# Altium project EP-GUIDE.PrjPcb
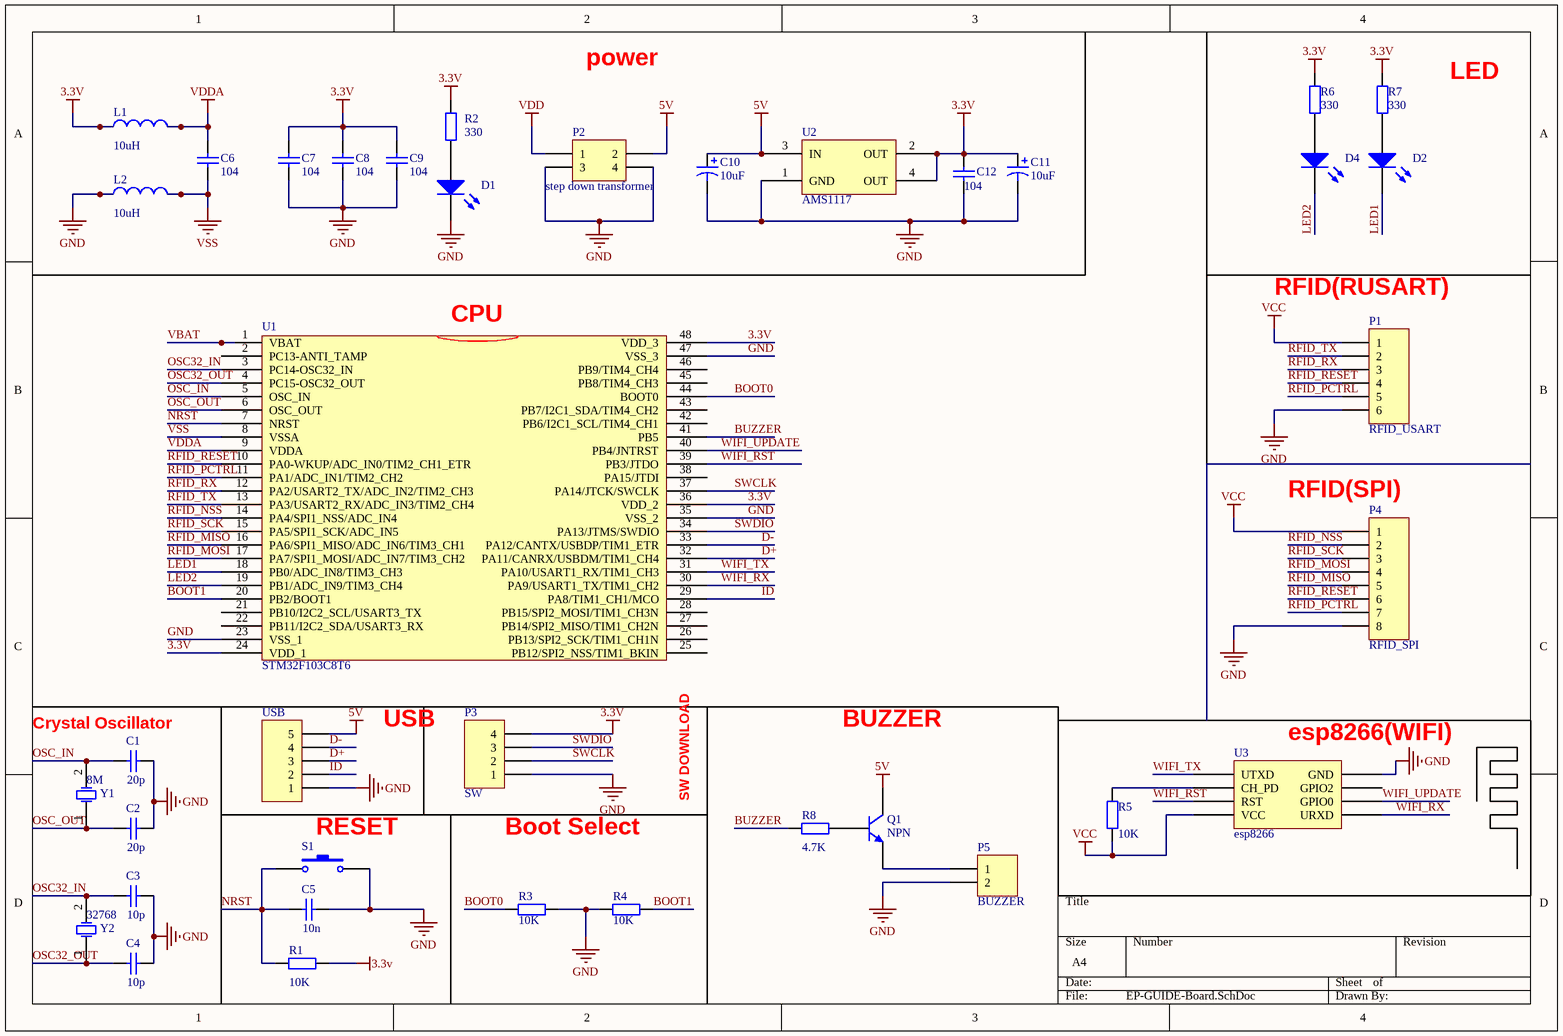
[diagram p0: EP-GUIDE-Board.SchDoc]
2 sheets, 76 parts. Net scope: global (net labels, ports and power ports of the same name join across sheets).
Sheets:
  EP-GUIDE-Board.SchDoc
  EP-GUIDE-Board2.SchDoc

## Sheet EP-GUIDE-Board.SchDoc
size A4

### Parts
(Parts that share a designator on the sheet are numbered #1, #2 ... from top to bottom, then left to right.)
C1#1  value 20p  [RAD-0.3]  (hidden comment: Cap)
C2#1  value 20p  [RAD-0.3]  (hidden comment: Cap)
C3#1  value 10p  [RAD-0.3]  (hidden comment: Cap)
C4#1  value 10p  [RAD-0.3]  (hidden comment: Cap)
C5#1  value 10n  [RAD-0.3]  (hidden comment: Cap)
C6#1  value 104  [RAD-0.3]  (hidden comment: Cap)
C7#1  value 104  [RAD-0.3]  (hidden comment: Cap)
C8#1  value 104  [RAD-0.3]  (hidden comment: Cap)
C9#1  value 104  [RAD-0.3]  (hidden comment: Cap)
C10#1  value 10uF  [C0805]  (hidden comment: Cap Pol3)
C11#1  value 10uF  [C0805]  (hidden comment: Cap Pol3)
C12#1  value 104  [RAD-0.3]  (hidden comment: Cap)
D1#1  LED3  [3.5X2.8X1.9]  (value not drawn)
D2#1  LED3  [3.5X2.8X1.9]  (value not drawn)
D4#1  LED3  [3.5X2.8X1.9]  (value not drawn)
L1#1  value 10uH  [0402-A]  (hidden comment: Inductor)
L2#1  value 10uH  [0402-A]  (hidden comment: Inductor)
P1#1  RFID_USART  [HDR1X6]
P2#1  step down transformer  [HDR2X2]
P3#1  SW  [HDR1X4]
P4#1  RFID_SPI  [HDR1X8]
P5#1  BUZZER  [HDR1X2]
Q1#1  NPN  [TO-226-AA]
R1#1  value 10K  [AXIAL-0.4]  (hidden comment: Res2)
R2#1  value 330  [AXIAL-0.4]  (hidden comment: Res2)
R3#1  value 10K  [AXIAL-0.4]  (hidden comment: Res2)
R4#1  value 10K  [AXIAL-0.4]  (hidden comment: Res2)
R5#1  value 10K  [AXIAL-0.4]  (hidden comment: Res2)
R6#1  value 330  [AXIAL-0.4]  (hidden comment: Res2)
R7#1  value 330  [AXIAL-0.4]  (hidden comment: Res2)
R8#1  value 4.7K  [AXIAL-0.4]  (hidden comment: Res2)
S1#1  SW-PB  [SPST-2]  (value not drawn)
U1#1  STM32F103C8T6  [LQFP48S]
U2#1  AMS1117  [SOT-223]
U3#1  esp8266
USB#1  USB  [Micro_USB]  (value not drawn)
Y1#1  8M  [R38]
Y2#1  32768  [R38]

### Blocks framed on the sheet
esp8266(WIFI): R5#1 U3#1

### Nets
3.3V: C7#1.1 C8#1.1 C9#1.1 C11#1.1 C12#1.1 L1#1.1 P3#1.4 R1#1.2 R2#1.2 R6#1.2 R7#1.2 U1#1.24(VDD_1) U1#1.36(VDD_2) U1#1.48(VDD_3) U2#1.2(OUT) U2#1.4(OUT)
5V: C10#1.1 P2#1.2 Q1#1.1(C) U2#1.3(IN) USB#1.5
GND: C1#1.2 C2#1.2 C3#1.2 C4#1.2 C5#1.2 C7#1.2 C8#1.2 C9#1.2 C10#1.2 C11#1.2 C12#1.2 D1#1.2(K) L2#1.1 P1#1.6 P2#1.3 P2#1.4 P3#1.1 P4#1.8 P5#1.2 R3#1.2 R4#1.1 S1#1.2 U1#1.23(VSS_1) U1#1.35(VSS_2) U1#1.47(VSS_3) U2#1.1(GND) U3#1.?5(GND) USB#1.1
VCC: P1#1.1 P4#1.1 R5#1.1 U3#1.?4(VCC)
VDD: P2#1.1
VDDA: C6#1.2 L1#1.2 U1#1.9(VDDA)
VSS: C6#1.1 L2#1.2 U1#1.8(VSSA)
BOOT0: R3#1.1 U1#1.44(BOOT0)
BOOT1: R4#1.2 U1#1.20(PB2/BOOT1)
BUZZER: R8#1.1 U1#1.41(PB5)
D+: U1#1.32(PA11/CANRX/USBDM/TIM1_CH4) USB#1.3
D-: U1#1.33(PA12/CANTX/USBDP/TIM1_ETR) USB#1.4
ID: U1#1.29(PA8/TIM1_CH1/MCO) USB#1.2
LED1: D2#1.2(K) U1#1.18(PB0/ADC_IN8/TIM3_CH3)
LED2: D4#1.2(K) U1#1.19(PB1/ADC_IN9/TIM3_CH4)
NRST: C5#1.1 R1#1.1 S1#1.1 U1#1.7(NRST)
OSC32_IN: C3#1.1 U1#1.3(PC14-OSC32_IN) Y2#1.2(OSC2)
OSC32_OUT: C4#1.1 U1#1.4(PC15-OSC32_OUT) Y2#1.1(OSC1)
OSC_IN: C1#1.1 U1#1.5(OSC_IN) Y1#1.2(OSC2)
OSC_OUT: C2#1.1 U1#1.6(OSC_OUT) Y1#1.1(OSC1)
RFID_MISO: P4#1.5 U1#1.16(PA6/SPI1_MISO/ADC_IN6/TIM3_CH1)
RFID_MOSI: P4#1.4 U1#1.17(PA7/SPI1_MOSI/ADC_IN7/TIM3_CH2)
RFID_NSS: P4#1.2 U1#1.14(PA4/SPI1_NSS/ADC_IN4)
RFID_PCTRL: P1#1.5 P4#1.7 U1#1.11(PA1/ADC_IN1/TIM2_CH2)
RFID_RESET: P1#1.4 P4#1.6 U1#1.10(PA0-WKUP/ADC_IN0/TIM2_CH1_ETR)
RFID_RX: P1#1.3 U1#1.12(PA2/USART2_TX/ADC_IN2/TIM2_CH3)
RFID_SCK: P4#1.3 U1#1.15(PA5/SPI1_SCK/ADC_IN5)
RFID_TX: P1#1.2 U1#1.13(PA3/USART2_RX/ADC_IN3/TIM2_CH4)
SWCLK: P3#1.2 U1#1.37(PA14/JTCK/SWCLK)
SWDIO: P3#1.3 U1#1.34(PA13/JTMS/SWDIO) U1#1.39(PB3/JTDO) U3#1.?3(RST)  [also labelled WIFI_RST]
VBAT: U1#1.1(VBAT)
WIFI_RX: U1#1.30(PA9/USART1_TX/TIM1_CH2) U3#1.?8(URXD)
WIFI_TX: U1#1.31(PA10/USART1_RX/TIM1_CH3) U3#1.?1(UTXD)
WIFI_UPDATE: U1#1.40(PB4/JNTRST) U3#1.?7(GPIO0)
NetD1#1_1: D1#1.1(A) R2#1.1
NetD2#1_1: D2#1.1(A) R7#1.1
NetD4#1_1: D4#1.1(A) R6#1.1
NetP5#1_1: P5#1.1 Q1#1.3(E)
NetQ1#1_2: Q1#1.2(B) R8#1.2
NetR5#1_2: R5#1.2 U3#1.?2(CH_PD)

Not connected (* = marked no-connect by the designer): U1#1 2(PC13-ANTI_TAMP) 21(PB10/I2C2_SCL/USART3_TX) 22(PB11/I2C2_SDA/USART3_RX) 25(PB12/SPI2_NSS/TIM1_BKIN) 26(PB13/SPI2_SCK/TIM1_CH1N) 27(PB14/SPI2_MISO/TIM1_CH2N) 28(PB15/SPI2_MOSI/TIM1_CH3N) 38(PA15/JTDI) 42(PB6/I2C1_SCL/TIM4_CH1) 43(PB7/I2C1_SDA/TIM4_CH2) 45(PB8/TIM4_CH3) 46(PB9/TIM4_CH4); U3#1 ?6(GPIO2)

### Notes on the sheet
- power
- LED
- (near P1#1) RFID(RUSART)
- (near U1#1) CPU
- (near P4#1) RFID(SPI)
- (near C1#1) Crystal Oscillator
- USB
- BUZZER
- RESET
- (near P3#1) Boot Select
- SW DOWNLOAD

### Library data of the parts
C1#1 C2#1 C3#1 C4#1 C5#1 C6#1 C7#1 C8#1 C9#1 C12#1 = Cap: Capacitor; Published: 8-Jun-2000; LatestRevisionDate: 17-Jul-2002; LatestRevisionNote: Re-released for DXP Platform.; PackageReference: RAD-0.3; Publisher: Altium Limited; PackageDescription: Radial Cap, Thru-Hole; 2 Leads; 0.3 in Pin Spacing
C10#1 C11#1 = Cap Pol3: Polarized Capacitor (Surface Mount); Published: 8-Jun-2000; LatestRevisionDate: 29-May-2009; LatestRevisionNote: IPC-7351 Footprint Added.; PackageReference: C0805; Publisher: Altium Limited; PackageDescription: Chip Capacitor
D1#1 D2#1 D4#1 = LED3: Typical BLUE SiC LED; Published: 8-Jun-2000; LatestRevisionDate: 17-Dec-2003; LatestRevisionNote: PCB Footprint replaced.; DatasheetVersion: 16-Apr-2002; PackageVersion: 16-Apr-2002; PackageReference: 3.5X2.8X1.9; Publisher: Altium Limited; PackageDescription: SM LED; 2 C-Bend Leads; Body 3.5 x 2.8 x 1.9 mm, inc leads (LxWxH typ)
L1#1 L2#1 = Inductor: Code_IEC: 1005; Published: 8-Jun-2000; LatestRevisionDate: 29-May-2009; LatestRevisionNote: IPC-7351 Footprint Added.; PackageReference: 0402-A; Publisher: Altium Limited; PackageDescription: Chip Inductor; Code_JEITA: 0402
P1#1 = Header 6: Header, 6-Pin; LatestRevisionDate: 17-Jul-2002; LatestRevisionNote: Re-released for DXP Platform.; Publisher: Altium Limited
P2#1 = Header 2X2: Header, 2-Pin, Dual row; LatestRevisionDate: 17-Jul-2002; LatestRevisionNote: Re-released for DXP Platform.; Publisher: Altium Limited
P3#1 = Header 4: Header, 4-Pin; LatestRevisionDate: 17-Jul-2002; LatestRevisionNote: Re-released for DXP Platform.; Publisher: Altium Limited
P4#1 = Header 8: Header, 8-Pin; LatestRevisionDate: 17-Jul-2002; LatestRevisionNote: Re-released for DXP Platform.; Publisher: Altium Limited
P5#1 = Header 2: Header, 2-Pin; LatestRevisionDate: 17-Jul-2002; LatestRevisionNote: Re-released for DXP Platform.; Publisher: Altium Limited
Q1#1 = NPN: NPN Bipolar Transistor; Published: 8-Jun-2000; LatestRevisionDate: 17-Jul-2002; LatestRevisionNote: Re-released for DXP Platform.; PackageReference: TO-226-AA; Publisher: Altium Limited; PackageDescription: TO, Flat Index; 3 In-Line, Axial Leads; Body Dia. 4.8mm; Leads 0.55 x 0.51 mm (max); Code_JEDEC: TO-226-AA
R1#1 R2#1 R3#1 R4#1 R5#1 R6#1 R7#1 R8#1 = Res2: Resistor; Published: 8-Jun-2000; LatestRevisionDate: 17-Jul-2002; LatestRevisionNote: Re-released for DXP Platform.; PackageReference: AXIAL-0.4; Publisher: Altium Limited; PackageDescription: Axial Device, Thru-Hole; 2 Leads; 0.4 in Pin Spacing
S1#1 = SW-PB: Switch; Published: 24-Mar-1999; LatestRevisionDate: 17-Jul-2002; LatestRevisionNote: Re-released for DXP Platform.; PackageReference: SPST-2; Publisher: Altium Limited; PackageDescription: Switch; 2 Leads
U1#1 = STM32F103C6
USB#1 = Header 5: Header, 5-Pin; LatestRevisionDate: 17-Jul-2002; LatestRevisionNote: Re-released for DXP Platform.; Publisher: Altium Limited
Y1#1 Y2#1 = XTAL: Crystal Oscillator; Published: 8-Jun-2000; LatestRevisionDate: 17-Jul-2002; LatestRevisionNote: Re-released for DXP Platform.; PackageReference: R38; Publisher: Altium Limited; PackageDescription: Crystal, Thru-Hole; 2 Leads; Body 3.1 x 8.2 mm (Dia.xH)

## Sheet EP-GUIDE-Board2.SchDoc
size A4
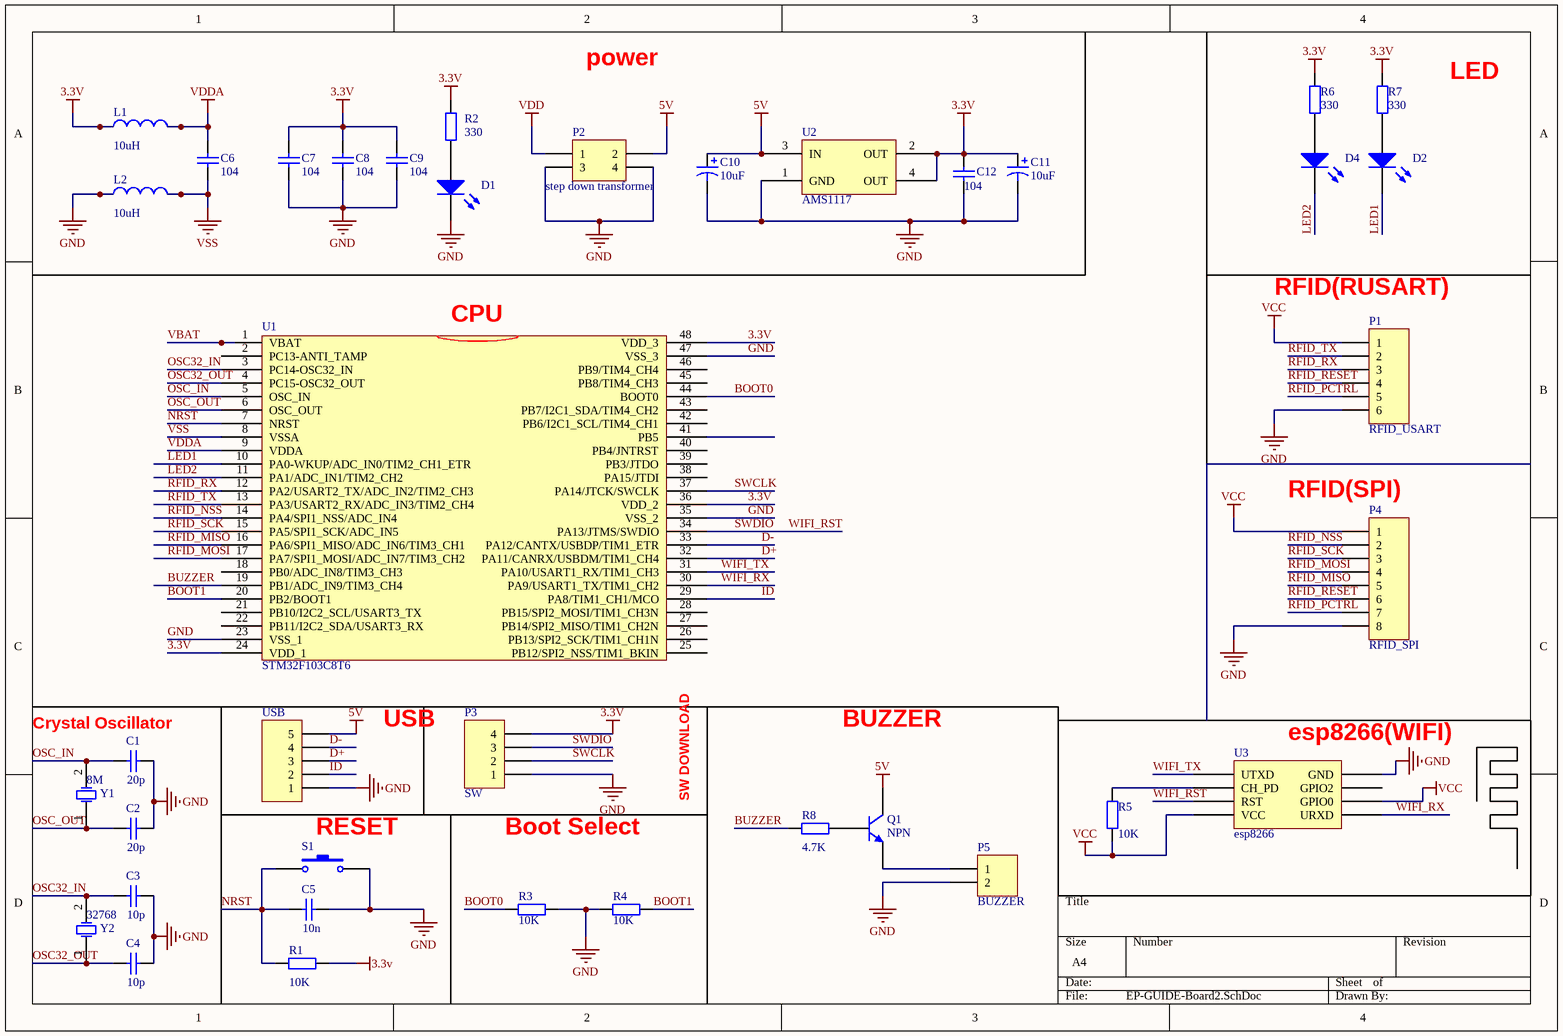
[diagram p1: EP-GUIDE-Board2.SchDoc]

### Parts
(Parts that share a designator on the sheet are numbered #1, #2 ... from top to bottom, then left to right.)
C1#2  value 20p  [RAD-0.3]  (hidden comment: Cap)
C2#2  value 20p  [RAD-0.3]  (hidden comment: Cap)
C3#2  value 10p  [RAD-0.3]  (hidden comment: Cap)
C4#2  value 10p  [RAD-0.3]  (hidden comment: Cap)
C5#2  value 10n  [RAD-0.3]  (hidden comment: Cap)
C6#2  value 104  [RAD-0.3]  (hidden comment: Cap)
C7#2  value 104  [RAD-0.3]  (hidden comment: Cap)
C8#2  value 104  [RAD-0.3]  (hidden comment: Cap)
C9#2  value 104  [RAD-0.3]  (hidden comment: Cap)
C10#2  value 10uF  [C0805]  (hidden comment: Cap Pol3)
C11#2  value 10uF  [C0805]  (hidden comment: Cap Pol3)
C12#2  value 104  [RAD-0.3]  (hidden comment: Cap)
D1#2  LED3  [3.5X2.8X1.9]  (value not drawn)
D2#2  LED3  [3.5X2.8X1.9]  (value not drawn)
D4#2  LED3  [3.5X2.8X1.9]  (value not drawn)
L1#2  value 10uH  [0402-A]  (hidden comment: Inductor)
L2#2  value 10uH  [0402-A]  (hidden comment: Inductor)
P1#2  RFID_USART  [HDR1X6]
P2#2  step down transformer  [HDR2X2]
P3#2  SW  [HDR1X4]
P4#2  RFID_SPI  [HDR1X8]
P5#2  BUZZER  [HDR1X2]
Q1#2  NPN  [TO-226-AA]
R1#2  value 10K  [AXIAL-0.4]  (hidden comment: Res2)
R2#2  value 330  [AXIAL-0.4]  (hidden comment: Res2)
R3#2  value 10K  [AXIAL-0.4]  (hidden comment: Res2)
R4#2  value 10K  [AXIAL-0.4]  (hidden comment: Res2)
R5#2  value 10K  [AXIAL-0.4]  (hidden comment: Res2)
R6#2  value 330  [AXIAL-0.4]  (hidden comment: Res2)
R7#2  value 330  [AXIAL-0.4]  (hidden comment: Res2)
R8#2  value 4.7K  [AXIAL-0.4]  (hidden comment: Res2)
S1#2  SW-PB  [SPST-2]  (value not drawn)
U1#2  STM32F103C8T6  [LQFP48S]
U2#2  AMS1117  [SOT-223]
U3#2  esp8266
USB#2  USB  [Micro_USB]  (value not drawn)
Y1#2  8M  [R38]
Y2#2  32768  [R38]

### Blocks framed on the sheet
esp8266(WIFI): R5#2 U3#2

### Nets
3.3V: C7#2.1 C8#2.1 C9#2.1 C11#2.1 C12#2.1 L1#2.1 P3#2.4 R1#2.2 R2#2.2 R6#2.2 R7#2.2 U1#2.24(VDD_1) U1#2.36(VDD_2) U1#2.48(VDD_3) U2#2.2(OUT) U2#2.4(OUT)
5V: C10#2.1 P2#2.2 Q1#2.1(C) U2#2.3(IN) USB#2.5
GND: C1#2.2 C2#2.2 C3#2.2 C4#2.2 C5#2.2 C7#2.2 C8#2.2 C9#2.2 C10#2.2 C11#2.2 C12#2.2 D1#2.2(K) L2#2.1 P1#2.6 P2#2.3 P2#2.4 P3#2.1 P4#2.8 P5#2.2 R3#2.2 R4#2.1 S1#2.2 U1#2.23(VSS_1) U1#2.35(VSS_2) U1#2.47(VSS_3) U2#2.1(GND) U3#2.?5(GND) USB#2.1
VCC: P1#2.1 P4#2.1 R5#2.1 U3#2.?4(VCC) U3#2.?7(GPIO0)
VDD: P2#2.1
VDDA: C6#2.2 L1#2.2 U1#2.9(VDDA)
VSS: C6#2.1 L2#2.2 U1#2.8(VSSA)
BOOT0: R3#2.1 U1#2.44(BOOT0)
BOOT1: R4#2.2 U1#2.20(PB2/BOOT1)
BUZZER: R8#2.1 U1#2.19(PB1/ADC_IN9/TIM3_CH4)
D+: U1#2.32(PA11/CANRX/USBDM/TIM1_CH4) USB#2.3
D-: U1#2.33(PA12/CANTX/USBDP/TIM1_ETR) USB#2.4
ID: U1#2.29(PA8/TIM1_CH1/MCO) USB#2.2
LED1: D2#2.2(K) U1#2.10(PA0-WKUP/ADC_IN0/TIM2_CH1_ETR)
LED2: D4#2.2(K) U1#2.11(PA1/ADC_IN1/TIM2_CH2)
NRST: C5#2.1 R1#2.1 S1#2.1 U1#2.7(NRST)
OSC32_IN: C3#2.1 U1#2.3(PC14-OSC32_IN) Y2#2.2(OSC2)
OSC32_OUT: C4#2.1 U1#2.4(PC15-OSC32_OUT) Y2#2.1(OSC1)
OSC_IN: C1#2.1 U1#2.5(OSC_IN) Y1#2.2(OSC2)
OSC_OUT: C2#2.1 U1#2.6(OSC_OUT) Y1#2.1(OSC1)
RFID_MISO: P4#2.5 U1#2.16(PA6/SPI1_MISO/ADC_IN6/TIM3_CH1)
RFID_MOSI: P4#2.4 U1#2.17(PA7/SPI1_MOSI/ADC_IN7/TIM3_CH2)
RFID_NSS: P4#2.2 U1#2.14(PA4/SPI1_NSS/ADC_IN4)
RFID_PCTRL: P1#2.5 P4#2.7
RFID_RESET: P1#2.4 P4#2.6
RFID_RX: P1#2.3 U1#2.12(PA2/USART2_TX/ADC_IN2/TIM2_CH3)
RFID_SCK: P4#2.3 U1#2.15(PA5/SPI1_SCK/ADC_IN5)
RFID_TX: P1#2.2 U1#2.13(PA3/USART2_RX/ADC_IN3/TIM2_CH4)
SWCLK: P3#2.2 U1#2.37(PA14/JTCK/SWCLK)
SWDIO: P3#2.3 U1#2.34(PA13/JTMS/SWDIO) U3#2.?3(RST)  [also labelled WIFI_RST]
VBAT: U1#2.1(VBAT)
WIFI_RX: U1#2.30(PA9/USART1_TX/TIM1_CH2) U3#2.?8(URXD)
WIFI_TX: U1#2.31(PA10/USART1_RX/TIM1_CH3) U3#2.?1(UTXD)
NetD1#2_1: D1#2.1(A) R2#2.1
NetD2#2_1: D2#2.1(A) R7#2.1
NetD4#2_1: D4#2.1(A) R6#2.1
NetP5#2_1: P5#2.1 Q1#2.3(E)
NetQ1#2_2: Q1#2.2(B) R8#2.2
NetR5#2_2: R5#2.2 U3#2.?2(CH_PD)

Not connected (* = marked no-connect by the designer): U1#2 2(PC13-ANTI_TAMP) 18(PB0/ADC_IN8/TIM3_CH3) 21(PB10/I2C2_SCL/USART3_TX) 22(PB11/I2C2_SDA/USART3_RX) 25(PB12/SPI2_NSS/TIM1_BKIN) 26(PB13/SPI2_SCK/TIM1_CH1N) 27(PB14/SPI2_MISO/TIM1_CH2N) 28(PB15/SPI2_MOSI/TIM1_CH3N) 38(PA15/JTDI) 39(PB3/JTDO) 40(PB4/JNTRST) 41(PB5) 42(PB6/I2C1_SCL/TIM4_CH1) 43(PB7/I2C1_SDA/TIM4_CH2) 45(PB8/TIM4_CH3) 46(PB9/TIM4_CH4); U3#2 ?6(GPIO2)

### Notes on the sheet
- power
- LED
- (near P1#2) RFID(RUSART)
- (near U1#2) CPU
- (near P4#2) RFID(SPI)
- (near C1#2) Crystal Oscillator
- USB
- BUZZER
- RESET
- (near P3#2) Boot Select
- SW DOWNLOAD

### Library data of the parts
C1#2 C2#2 C3#2 C4#2 C5#2 C6#2 C7#2 C8#2 C9#2 C12#2 = Cap: Capacitor; Published: 8-Jun-2000; LatestRevisionDate: 17-Jul-2002; LatestRevisionNote: Re-released for DXP Platform.; PackageReference: RAD-0.3; Publisher: Altium Limited; PackageDescription: Radial Cap, Thru-Hole; 2 Leads; 0.3 in Pin Spacing
C10#2 C11#2 = Cap Pol3: Polarized Capacitor (Surface Mount); Published: 8-Jun-2000; LatestRevisionDate: 29-May-2009; LatestRevisionNote: IPC-7351 Footprint Added.; PackageReference: C0805; Publisher: Altium Limited; PackageDescription: Chip Capacitor
D1#2 D2#2 D4#2 = LED3: Typical BLUE SiC LED; Published: 8-Jun-2000; LatestRevisionDate: 17-Dec-2003; LatestRevisionNote: PCB Footprint replaced.; DatasheetVersion: 16-Apr-2002; PackageVersion: 16-Apr-2002; PackageReference: 3.5X2.8X1.9; Publisher: Altium Limited; PackageDescription: SM LED; 2 C-Bend Leads; Body 3.5 x 2.8 x 1.9 mm, inc leads (LxWxH typ)
L1#2 L2#2 = Inductor: Code_IEC: 1005; Published: 8-Jun-2000; LatestRevisionDate: 29-May-2009; LatestRevisionNote: IPC-7351 Footprint Added.; PackageReference: 0402-A; Publisher: Altium Limited; PackageDescription: Chip Inductor; Code_JEITA: 0402
P1#2 = Header 6: Header, 6-Pin; LatestRevisionDate: 17-Jul-2002; LatestRevisionNote: Re-released for DXP Platform.; Publisher: Altium Limited
P2#2 = Header 2X2: Header, 2-Pin, Dual row; LatestRevisionDate: 17-Jul-2002; LatestRevisionNote: Re-released for DXP Platform.; Publisher: Altium Limited
P3#2 = Header 4: Header, 4-Pin; LatestRevisionDate: 17-Jul-2002; LatestRevisionNote: Re-released for DXP Platform.; Publisher: Altium Limited
P4#2 = Header 8: Header, 8-Pin; LatestRevisionDate: 17-Jul-2002; LatestRevisionNote: Re-released for DXP Platform.; Publisher: Altium Limited
P5#2 = Header 2: Header, 2-Pin; LatestRevisionDate: 17-Jul-2002; LatestRevisionNote: Re-released for DXP Platform.; Publisher: Altium Limited
Q1#2 = NPN: NPN Bipolar Transistor; Published: 8-Jun-2000; LatestRevisionDate: 17-Jul-2002; LatestRevisionNote: Re-released for DXP Platform.; PackageReference: TO-226-AA; Publisher: Altium Limited; PackageDescription: TO, Flat Index; 3 In-Line, Axial Leads; Body Dia. 4.8mm; Leads 0.55 x 0.51 mm (max); Code_JEDEC: TO-226-AA
R1#2 R2#2 R3#2 R4#2 R5#2 R6#2 R7#2 R8#2 = Res2: Resistor; Published: 8-Jun-2000; LatestRevisionDate: 17-Jul-2002; LatestRevisionNote: Re-released for DXP Platform.; PackageReference: AXIAL-0.4; Publisher: Altium Limited; PackageDescription: Axial Device, Thru-Hole; 2 Leads; 0.4 in Pin Spacing
S1#2 = SW-PB: Switch; Published: 24-Mar-1999; LatestRevisionDate: 17-Jul-2002; LatestRevisionNote: Re-released for DXP Platform.; PackageReference: SPST-2; Publisher: Altium Limited; PackageDescription: Switch; 2 Leads
U1#2 = STM32F103C6
USB#2 = Header 5: Header, 5-Pin; LatestRevisionDate: 17-Jul-2002; LatestRevisionNote: Re-released for DXP Platform.; Publisher: Altium Limited
Y1#2 Y2#2 = XTAL: Crystal Oscillator; Published: 8-Jun-2000; LatestRevisionDate: 17-Jul-2002; LatestRevisionNote: Re-released for DXP Platform.; PackageReference: R38; Publisher: Altium Limited; PackageDescription: Crystal, Thru-Hole; 2 Leads; Body 3.1 x 8.2 mm (Dia.xH)

## Nets that join several sheets
3.3V: EP-GUIDE-Board (16 pins), EP-GUIDE-Board2 (16 pins)
5V: EP-GUIDE-Board (5 pins), EP-GUIDE-Board2 (5 pins)
GND: EP-GUIDE-Board (28 pins), EP-GUIDE-Board2 (28 pins)
VCC: EP-GUIDE-Board (P1#1.1 P4#1.1 R5#1.1 U3#1.?4), EP-GUIDE-Board2 (5 pins)
VDD: EP-GUIDE-Board (P2#1.1), EP-GUIDE-Board2 (P2#2.1)
VDDA: EP-GUIDE-Board (C6#1.2 L1#1.2 U1#1.9), EP-GUIDE-Board2 (C6#2.2 L1#2.2 U1#2.9)
VSS: EP-GUIDE-Board (C6#1.1 L2#1.2 U1#1.8), EP-GUIDE-Board2 (C6#2.1 L2#2.2 U1#2.8)
BOOT0: EP-GUIDE-Board (R3#1.1 U1#1.44), EP-GUIDE-Board2 (R3#2.1 U1#2.44)
BOOT1: EP-GUIDE-Board (R4#1.2 U1#1.20), EP-GUIDE-Board2 (R4#2.2 U1#2.20)
BUZZER: EP-GUIDE-Board (R8#1.1 U1#1.41), EP-GUIDE-Board2 (R8#2.1 U1#2.19)
D+: EP-GUIDE-Board (U1#1.32 USB#1.3), EP-GUIDE-Board2 (U1#2.32 USB#2.3)
D-: EP-GUIDE-Board (U1#1.33 USB#1.4), EP-GUIDE-Board2 (U1#2.33 USB#2.4)
ID: EP-GUIDE-Board (U1#1.29 USB#1.2), EP-GUIDE-Board2 (U1#2.29 USB#2.2)
LED1: EP-GUIDE-Board (D2#1.2 U1#1.18), EP-GUIDE-Board2 (D2#2.2 U1#2.10)
LED2: EP-GUIDE-Board (D4#1.2 U1#1.19), EP-GUIDE-Board2 (D4#2.2 U1#2.11)
NRST: EP-GUIDE-Board (C5#1.1 R1#1.1 S1#1.1 U1#1.7), EP-GUIDE-Board2 (C5#2.1 R1#2.1 S1#2.1 U1#2.7)
OSC32_IN: EP-GUIDE-Board (C3#1.1 U1#1.3 Y2#1.2), EP-GUIDE-Board2 (C3#2.1 U1#2.3 Y2#2.2)
OSC32_OUT: EP-GUIDE-Board (C4#1.1 U1#1.4 Y2#1.1), EP-GUIDE-Board2 (C4#2.1 U1#2.4 Y2#2.1)
OSC_IN: EP-GUIDE-Board (C1#1.1 U1#1.5 Y1#1.2), EP-GUIDE-Board2 (C1#2.1 U1#2.5 Y1#2.2)
OSC_OUT: EP-GUIDE-Board (C2#1.1 U1#1.6 Y1#1.1), EP-GUIDE-Board2 (C2#2.1 U1#2.6 Y1#2.1)
RFID_MISO: EP-GUIDE-Board (P4#1.5 U1#1.16), EP-GUIDE-Board2 (P4#2.5 U1#2.16)
RFID_MOSI: EP-GUIDE-Board (P4#1.4 U1#1.17), EP-GUIDE-Board2 (P4#2.4 U1#2.17)
RFID_NSS: EP-GUIDE-Board (P4#1.2 U1#1.14), EP-GUIDE-Board2 (P4#2.2 U1#2.14)
RFID_PCTRL: EP-GUIDE-Board (P1#1.5 P4#1.7 U1#1.11), EP-GUIDE-Board2 (P1#2.5 P4#2.7)
RFID_RESET: EP-GUIDE-Board (P1#1.4 P4#1.6 U1#1.10), EP-GUIDE-Board2 (P1#2.4 P4#2.6)
RFID_RX: EP-GUIDE-Board (P1#1.3 U1#1.12), EP-GUIDE-Board2 (P1#2.3 U1#2.12)
RFID_SCK: EP-GUIDE-Board (P4#1.3 U1#1.15), EP-GUIDE-Board2 (P4#2.3 U1#2.15)
RFID_TX: EP-GUIDE-Board (P1#1.2 U1#1.13), EP-GUIDE-Board2 (P1#2.2 U1#2.13)
SWCLK: EP-GUIDE-Board (P3#1.2 U1#1.37), EP-GUIDE-Board2 (P3#2.2 U1#2.37)
SWDIO: EP-GUIDE-Board (P3#1.3 U1#1.34 U1#1.39 U3#1.?3), EP-GUIDE-Board2 (P3#2.3 U1#2.34 U3#2.?3)
VBAT: EP-GUIDE-Board (U1#1.1), EP-GUIDE-Board2 (U1#2.1)
WIFI_RX: EP-GUIDE-Board (U1#1.30 U3#1.?8), EP-GUIDE-Board2 (U1#2.30 U3#2.?8)
WIFI_TX: EP-GUIDE-Board (U1#1.31 U3#1.?1), EP-GUIDE-Board2 (U1#2.31 U3#2.?1)